# EAGLE design SX-VerteilerV3 (EAGLE 7.7.0)

## Sheet 1 of 2
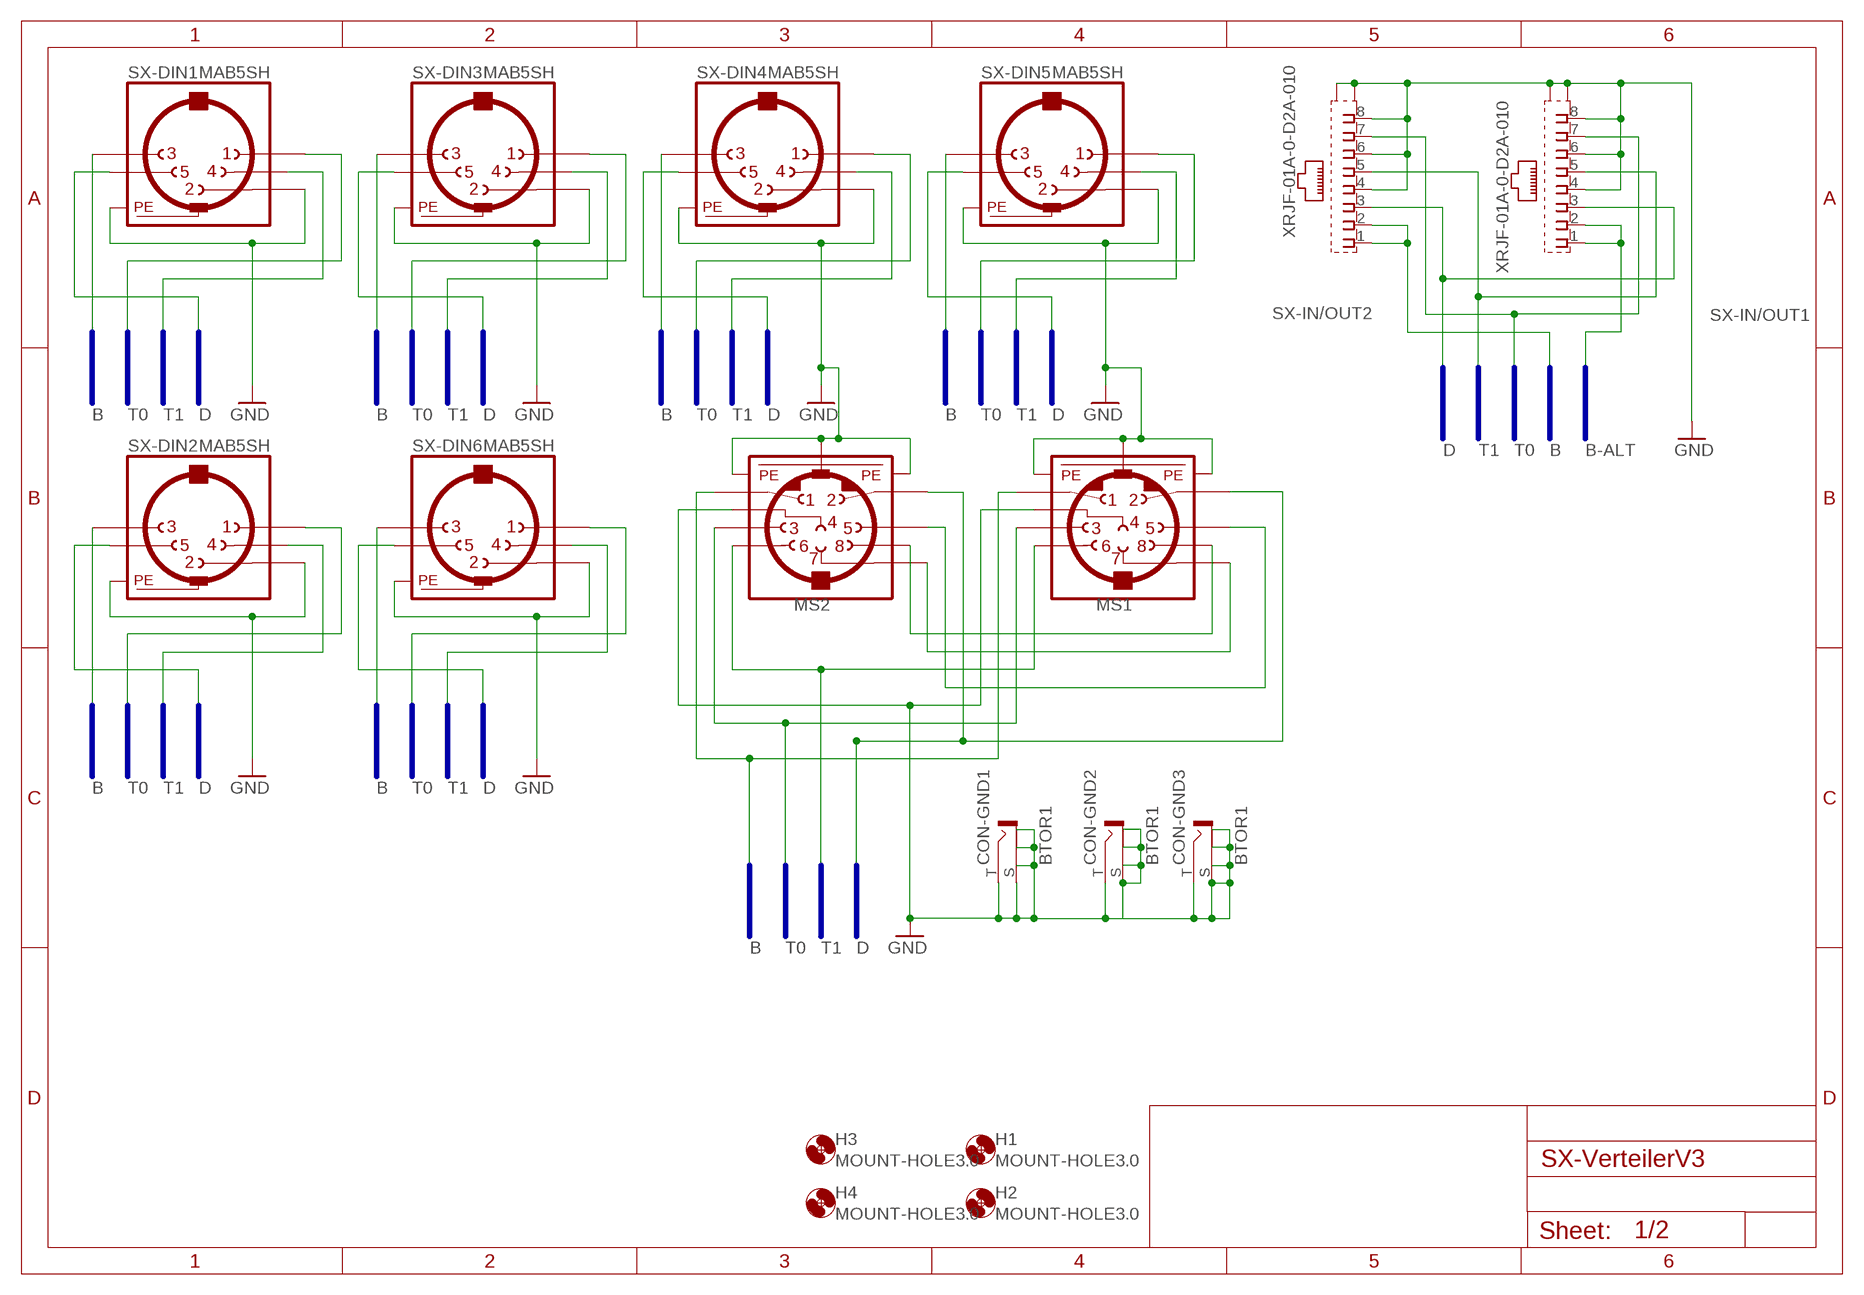
[diagram p0: schematic, sheet 1]

### Parts
CON-GND1  BTOR1  [BTOR1]
CON-GND2  BTOR1  [BTOR1]
CON-GND3  BTOR1  [BTOR1]
H1  MOUNT-HOLE3.0  [3,0]
H2  MOUNT-HOLE3.0  [3,0]
H3  MOUNT-HOLE3.0  [3,0]
H4  MOUNT-HOLE3.0  [3,0]
MS1  MINI_DIN_8  [M_DIN8]
MS2  MINI_DIN_8  [M_DIN8]
SX-DIN1  MAB5SH  [MAB5SH]
SX-DIN2  MAB5SH  [MAB5SH]
SX-DIN3  MAB5SH  [MAB5SH]
SX-DIN4  MAB5SH  [MAB5SH]
SX-DIN5  MAB5SH  [MAB5SH]
SX-DIN6  MAB5SH  [MAB5SH]
SX-IN/OUT1  XRJF-01A-0-D2A-010  [XRJF-01A-0-D2A-010]
SX-IN/OUT2  XRJF-01A-0-D2A-010  [XRJF-01A-0-D2A-010]

### Nets
B: MS1.1 MS2.1 SX-DIN1.3 SX-DIN2.3 SX-DIN3.3 SX-DIN4.3 SX-DIN5.3 SX-DIN6.3 SX-IN/OUT2.1 SX-IN/OUT2.2 ; also sheet 2
B-ALT: SX-IN/OUT1.1 SX-IN/OUT1.2 ; also sheet 2
D: MS1.2 MS2.2 SX-DIN1.5 SX-DIN2.5 SX-DIN3.5 SX-DIN4.5 SX-DIN5.5 SX-DIN6.5 SX-IN/OUT1.3 SX-IN/OUT2.3 ; also sheet 2
GND: CON-GND1.S CON-GND1.S@1 CON-GND1.S@2 CON-GND1.S@3 CON-GND1.T CON-GND2.S CON-GND2.S@1 CON-GND2.S@2 CON-GND2.S@3 CON-GND2.T CON-GND3.S CON-GND3.S@1 CON-GND3.S@2 CON-GND3.S@3 CON-GND3.T MS1.4 MS1.SH1(PE1) MS1.SH2(PE2) MS1.SH3(PE3) MS2.4 MS2.SH1(PE1) MS2.SH2(PE2) MS2.SH3(PE3) SX-DIN1.2 SX-DIN1.PE SX-DIN1.PE@(PE) SX-DIN2.2 SX-DIN2.PE SX-DIN2.PE@(PE) SX-DIN3.2 SX-DIN3.PE SX-DIN3.PE@(PE) SX-DIN4.2 SX-DIN4.PE SX-DIN4.PE@(PE) SX-DIN5.2 SX-DIN5.PE SX-DIN5.PE@(PE) SX-DIN6.2 SX-DIN6.PE SX-DIN6.PE@(PE) SX-IN/OUT1.4 SX-IN/OUT1.6 SX-IN/OUT1.8 SX-IN/OUT1.S1(S) SX-IN/OUT1.S2(S) SX-IN/OUT2.4 SX-IN/OUT2.6 SX-IN/OUT2.8 SX-IN/OUT2.S1(S) SX-IN/OUT2.S2(S) ; also sheet 2
N$1: MS1.8 MS2.8
N$3: MS1.7 MS2.7
N$5: MS1.5 MS2.5
T0: MS1.3 MS2.3 SX-DIN1.1 SX-DIN2.1 SX-DIN3.1 SX-DIN4.1 SX-DIN5.1 SX-DIN6.1 SX-IN/OUT1.7 SX-IN/OUT2.7 ; also sheet 2
T1: MS1.6 MS2.6 SX-DIN1.4 SX-DIN2.4 SX-DIN3.4 SX-DIN4.4 SX-DIN5.4 SX-DIN6.4 SX-IN/OUT1.5 SX-IN/OUT2.5 ; also sheet 2

### Buses
B
T0
T1
D
B-ALT

## Sheet 2 of 2
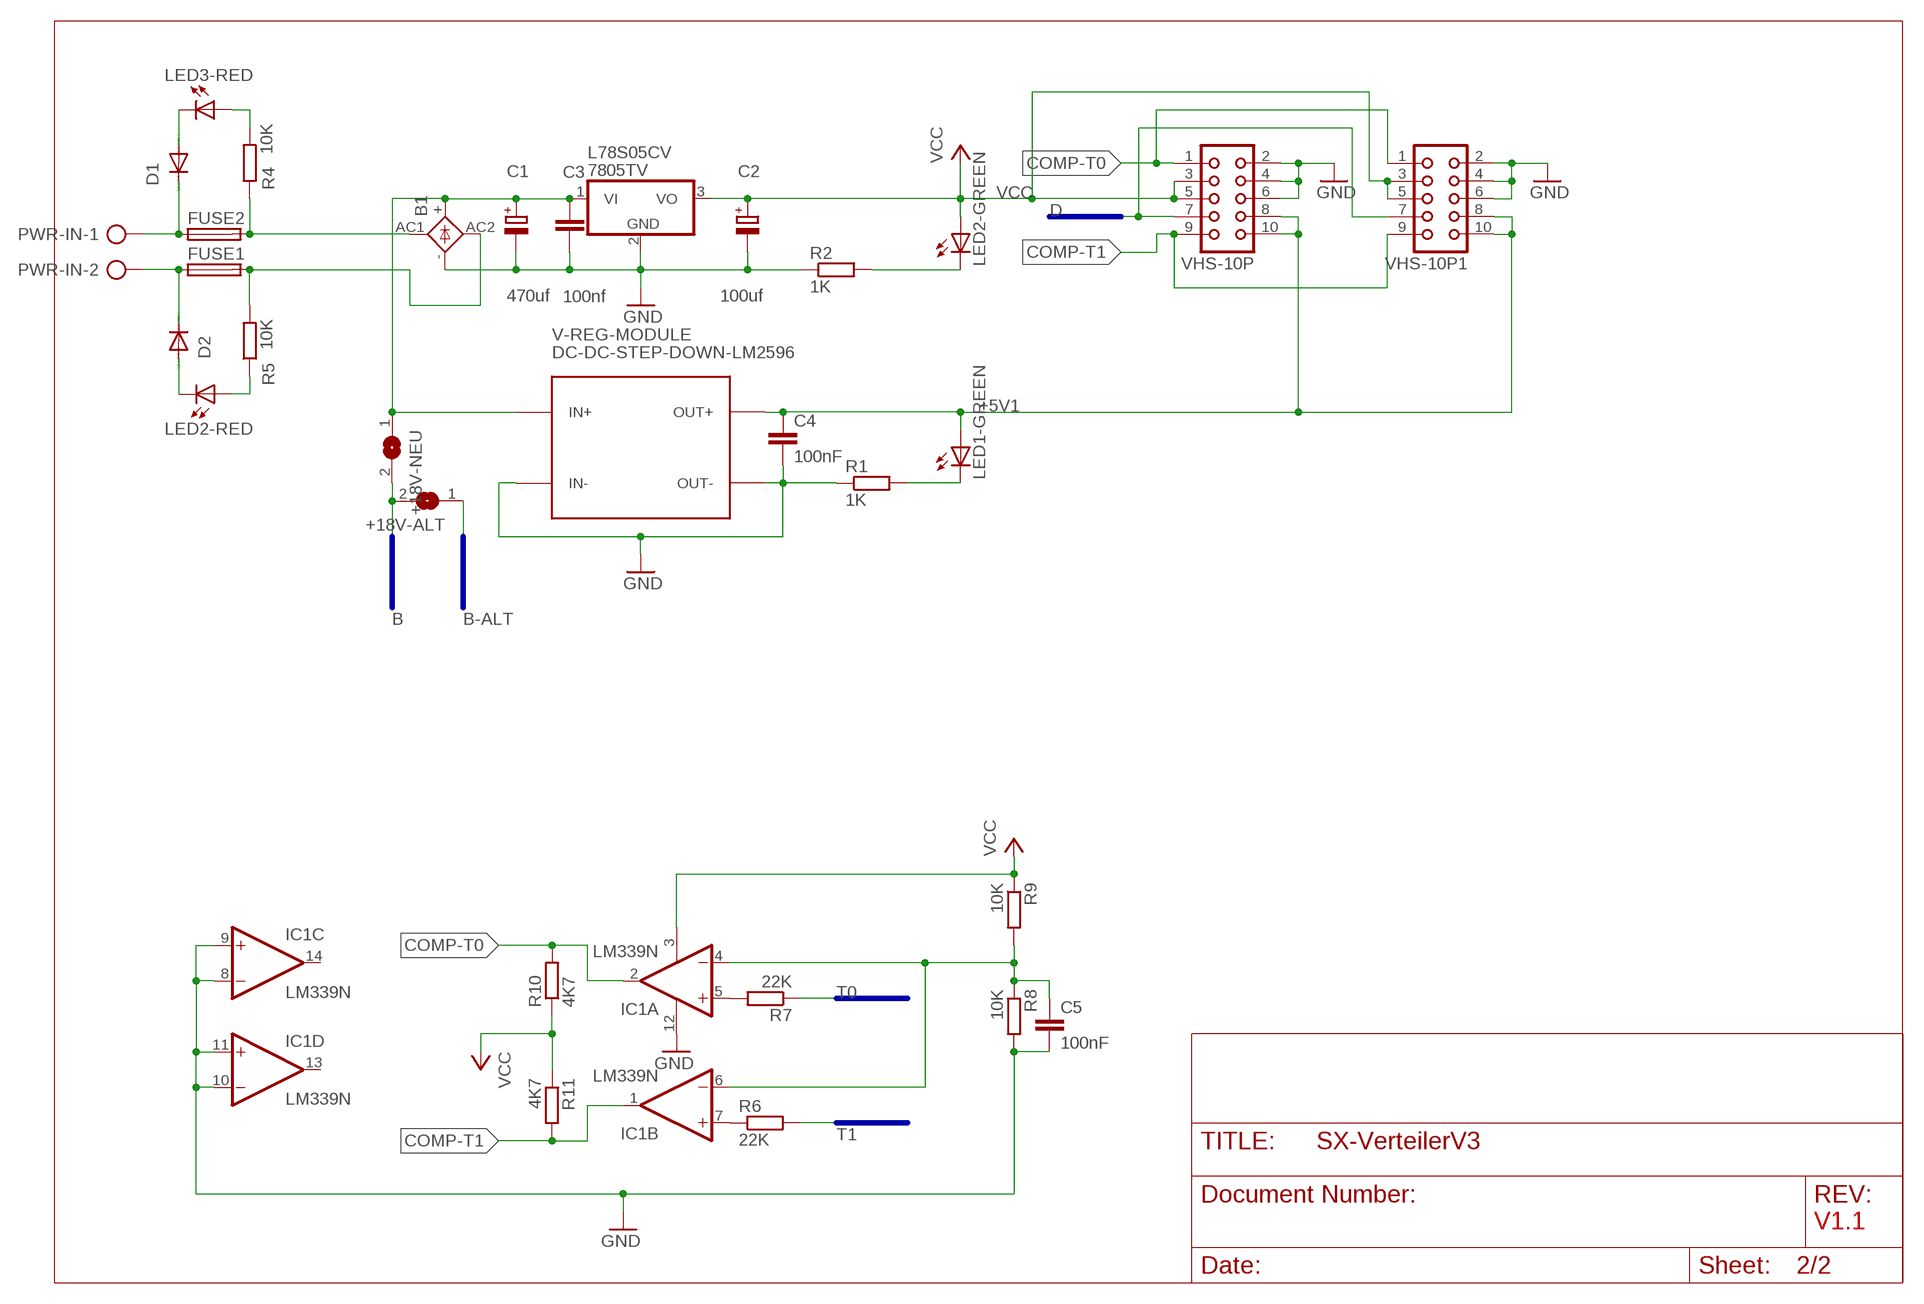
[diagram p1: schematic, sheet 2]

### Parts
+18V-ALT  SJW  [SJW]
+18V-NEU  SJW  [SJW]
B1  KBU  [KBU]
C1  470uf  CPOL-EUE5-13  [E5-13]
C2  100uf  CPOL-EUE3.5-8  [E3,5-8]
C3  100nf  C-EUC0805  [C0805]
C4  100nF  C-EUC0805  [C0805]
C5  100nF  C-EUC0805  [C0805]
D1  PMLL4150  [SOD80C]
D2  PMLL4150  [SOD80C]
FUSE1  FUSEBLANK_5X20MM  [FUSE_HOLDER_5X20MM]
FUSE2  FUSEBLANK_5X20MM  [FUSE_HOLDER_5X20MM]
IC1  LM339N  [DIL14]
L78S05CV  7805TV  [TO220V]
LED1-GREEN  LED3MM  [LED3MM]
LED2-GREEN  LED3MM  [LED3MM]
LED2-RED  LED3MM  [LED3MM]
LED3-RED  LED3MM  [LED3MM]
PWR-IN  AK300/2  [AK300/2]
R1  1K  R-EU_R0805  [R0805]
R2  1K  R-EU_R0805  [R0805]
R4  10K  R-EU_R0805  [R0805]
R5  10K  R-EU_R0805  [R0805]
R6  22K  R-EU_R0805  [R0805]
R7  22K  R-EU_R0805  [R0805]
R8  10K  R-EU_R0805  [R0805]
R9  10K  R-EU_R0805  [R0805]
R10  4K7  R-EU_R0805  [R0805]
R11  4K7  R-EU_R0805  [R0805]
V-REG-MODULE  DC-DC-STEP-DOWN-LM2596  [DC-DC-STEP-DOWN-LM2596]
VHS-10P  CON10  [CON10]
VHS-10P1  CON10  [CON10]

### Nets
+5V1: C4.1 LED1-GREEN.A V-REG-MODULE.OUT+ VHS-10P1.8 VHS-10P1.10 VHS-10P.8 VHS-10P.10
B: +18V-ALT.2 +18V-NEU.2 ; also sheet 1
B-ALT: +18V-ALT.1 ; also sheet 1
COMP-T0: IC1.2(A:OUT) R10.2 VHS-10P1.1 VHS-10P.1
COMP-T1: IC1.1(B:OUT) R11.2 VHS-10P1.9 VHS-10P.9
D: VHS-10P1.7 VHS-10P.7 ; also sheet 1
GND: B1.- C1.- C2.- C3.2 C4.2 C5.2 IC1.8(C:-IN) IC1.9(C:+IN) IC1.10(D:-IN) IC1.11(D:+IN) IC1.12(P:GND) L78S05CV.2(GND) R1.1 R2.1 R8.2 V-REG-MODULE.IN- V-REG-MODULE.OUT- VHS-10P1.2 VHS-10P1.4 VHS-10P1.6 VHS-10P.2 VHS-10P.4 VHS-10P.6 ; also sheet 1
N$2: D1.C FUSE2.1 PWR-IN.1
N$4: D2.C FUSE1.1 PWR-IN.2
N$6: B1.AC1 FUSE2.2 R4.1
N$7: B1.AC2 FUSE1.2 R5.2
N$8: D1.A LED3-RED.K(C)
N$9: IC1.5(A:+IN) R7.2
N$10: LED2-GREEN.K(C) R2.2
N$11: IC1.7(B:+IN) R6.1
N$12: LED1-GREEN.K(C) R1.2
N$13: LED3-RED.A R4.2
N$14: C5.1 IC1.4(A:-IN) IC1.6(B:-IN) R8.1 R9.2
N$15: D2.A LED2-RED.K(C)
N$16: LED2-RED.A R5.1
N$17: +18V-NEU.1 B1.+ C1.+ C3.1 L78S05CV.1(VI) V-REG-MODULE.IN+
T0: R7.1 ; also sheet 1
T1: R6.2 ; also sheet 1
VCC: C2.+ IC1.3(P:V+) L78S05CV.3(VO) LED2-GREEN.A R9.1 R10.1 R11.1 VHS-10P1.3 VHS-10P1.5 VHS-10P.3 VHS-10P.5
Unconnected: IC1.13(D:OUT) IC1.14(C:OUT)

### Buses
T1
T0
D
B
B-ALT

### Notes on the sheet
- V1.1

## Library data of the parts
+18V-ALT +18V-NEU = jumper:SJ: SMD solder JUMPER
B1 = rectifier:KBU: DIOTEC RECTIFIER
C1 C2 = resistor:CPOL-EU: POLARIZED CAPACITOR, European symbol
C3-C5 = resistor:C-EU: CAPACITOR, European symbol
CON-GND1-CON-GND3 = con-lumberg:BTOR1: RCA connectors according to JEITA RC-5231 Cinch RCA-Einbaukupplung nach JEITA RC-5231, stehende Ausführung Source: http://www.lumberg.de/Produkte/PDFs/BTOR1.pdf; OC_FARNELL: 1217030; OC_NEWARK: unknown
D1 D2 = diode:PMLL4150: DIODE high speed
FUSE1 FUSE2 = fuse:FUSE: Fuse; OC_FARNELL: unknown; OC_NEWARK: unknown
H1-H4 = holes:MOUNT-HOLE: MOUNTING HOLE with drill center marker
IC1 = linear:LM339: Low Power Low Offset Voltage Quad Comparators with open collector; LM139/LM239/LM339/LM2901/LM3302
L78S05CV = linear:78*: Positive VOLTAGE REGULATOR Source: http://cache.national.com/ds/LM/LM78L05.pdf http://www.fairchildsemi.com/ds/LM/LM7805.pdf
LED1-GREEN LED2-GREEN LED2-RED LED3-RED = led:LED: LED OSRAM: - CHIPLED LG R971, LG N971, LY N971, LG Q971, LY Q971, LO R971, LY R971 LH N974, LH R974 LS Q976, LO Q976, LY Q976 LO Q996 - Hyper CHIPLED LW Q18S LB Q993, LB Q99A, LB R99A - SideLED LS A670, LO A670, LY A670, LG A670, LP A670 LB A673, LV A673, LT A673, LW A673 LH A674 LY A675 LS A676, LA A676, LO A676, LY A676, LW A676 LS A679, LY A679, LG A679 - Hyper Micro SIDELED® LS Y876, LA Y876, LO Y876, LY Y876 LT Y87S - SmartLED LW L88C, LW L88S LB L89C, LB L89S, LG L890 LS L89K, LO L89K, LY L89K LS L896, LA L896, LO L896, LY L896 - TOPLED LS T670, LO T670, LY T670, LG T670, LP T670 LSG T670, LSP T670, LSY T670, LOP T670, LYG T670 LG T671, LOG T671, LSG T671 LB T673, LV T673, LT T673, LW T673 LH T674 LS T676, LA T676, LO T676, LY T676, LB T676, LH T676, LSB T676, LW T676 LB T67C, LV T67C, LT T67C, LS T67K, LO T67K, LY T67K, LW E67C LS E67B, LA E67B, LO E67B, LY E67B, LB E67C, LV E67C, LT E67C LW T67C LS T679, LY T679, LG T679 LS T770, LO T770, LY T770, LG T770, LP T770 LB T773, LV T773, LT T773, LW T773 LH T774 LS E675, LA E675, LY E675, LS T675 LS T776, LA T776, LO T776, LY T776, LB T776 LHGB T686 LT T68C, LB T68C - Hyper Mini TOPLED® LB M676 - Mini TOPLED Santana® LG M470 LS M47K, LO M47K, LY M47K Source: http://www.osram.convergy.de LUXEON: - LUMILED® LXK2-PW12-R00, LXK2-PW12-S00, LXK2-PW14-U00, LXK2-PW14-V00 LXK2-PM12-R00, LXK2-PM12-S00, LXK2-PM14-U00 LXK2-PE12-Q00, LXK2-PE12-R00, LXK2-PE12-S00, LXK2-PE14-T00, LXK2-PE14-U00 LXK2-PB12-K00, LXK2-PB12-L00, LXK2-PB12-M00, LXK2-PB14-N00, LXK2-PB14-P00, LXK2-PB14-Q00 LXK2-PR12-L00, LXK2-PR12-M00, LXK2-PR14-Q00, LXK2-PR14-R00 LXK2-PD12-Q00, LXK2-PD12-R00, LXK2-PD12-S00 LXK2-PH12-R00, LXK2-PH12-S00 LXK2-PL12-P00, LXK2-PL12-Q00, LXK2-PL12-R00 Source: www.luxeon.com KINGBRIGHT: KA-3528ASYC Source: www.kingbright.com
MS1 MS2 = mini_din:MINI_DIN_8
PWR-IN = con-ptr500:AK300/2: CONNECTOR; OC_FARNELL: unknown; OC_NEWARK: unknown
R1 R2 R4-R11 = resistor:R-EU_: RESISTOR, European symbol
SX-DIN1-SX-DIN6 = con-hirschmann:MAB5SH: Female CONNECTOR 5 pins 90 deg. with shield, horizontal (DIN 41524); OC_FARNELL: 809883; OC_NEWARK: unknown
SX-IN/OUT1 SX-IN/OUT2 = con-xmultiple:XRJF: RC45 schielded, without LED, with transformer, side entry PCB Jack Source: XRJF-01A-0-D2A-010(01).pdf
V-REG-MODULE = diy-modules:DC-DC-STEP-DOWN-LM2596: DC/DC Step-Down Regulator based on LM2596-ADJ chip
VHS-10P VHS-10P1 = con-harting:CON10: CONNECTOR; OC_FARNELL: unknown; OC_NEWARK: unknown

## Board
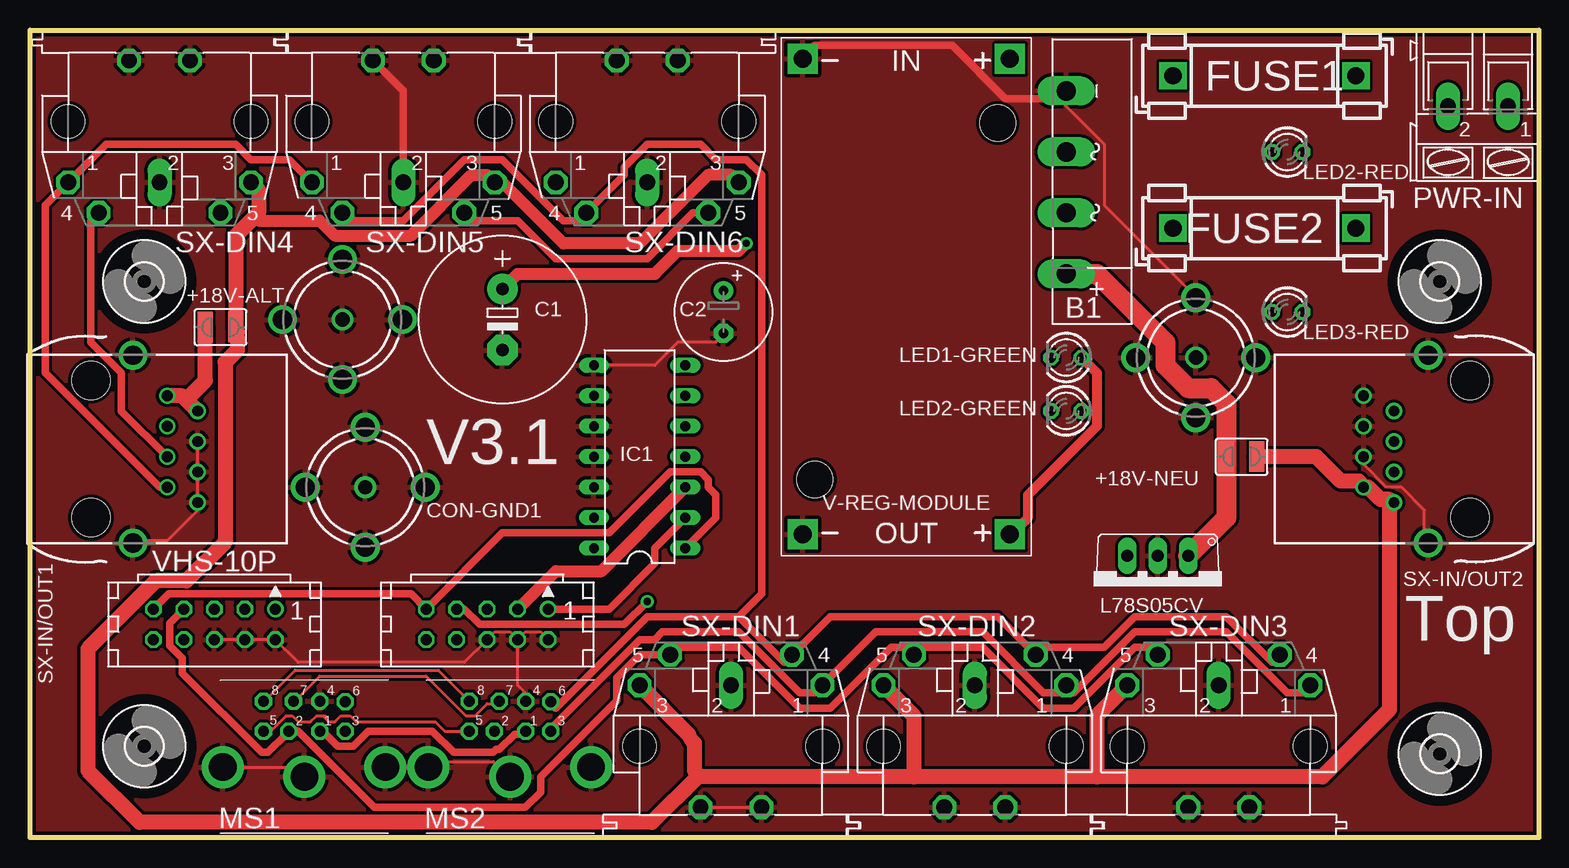
[diagram p2: board, top side]
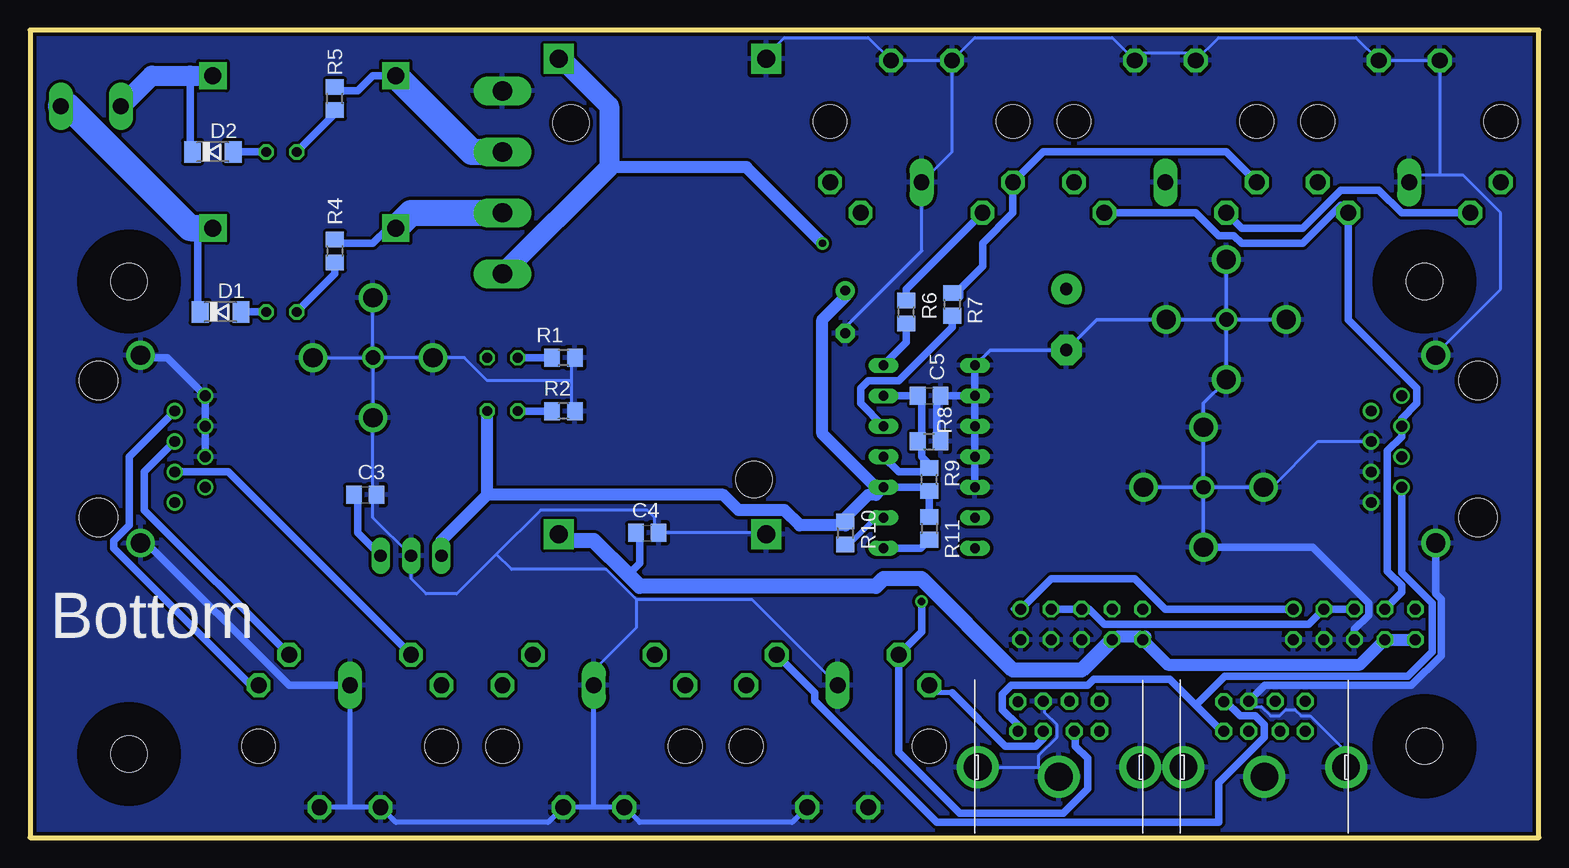
[diagram p3: board, bottom side, seen from below]

Size 125.73 x 67.31 mm. Coordinates in mm from the lower left corner, seen from the top.
Outline: 0,0 0,67.31 125.73,67.31 125.73,0 0,0
Copper layers (1*16): Top 0.035mm / dielectric 0.2mm / Bottom 0.035mm
Design rules "Eagle_WEdirekt_150_check *": minimum track width 6mil, minimum drill 0.25mm, track to track 6mil, track to pad 8mil, pad to pad 8mil, via to via 6mil, smd to smd 8mil, copper to edge 12mil, drill to drill 24mil, minimum pad ring 9mil, minimum via ring 9mil, stop-mask expansion 3mil, vias tented up to drill 0mil, thermal gap 12mil
bRestrict: area 54.6,25.4 to 55.2,26; area 54.6,24.8 to 55.2,25.4

### Footprints (pad centres in the part's own frame; a part is rotated, then mirrored left to right if it is on the bottom)
SJW = smd 1.27 x 2.54: 1 -1.27,0; 2 1.27,0
KBU = drill 1.6 long: + -7.62,2.54; - 7.62,2.54; AC1 -2.54,2.54; AC2 2.54,2.54
E5-13 = drill 1.016 pad 2.54: + -2.54,0 | drill 1.016 pad 2.54 octagon: - 2.54,0
E3,5-8 = drill 0.813 pad 1.6: + -1.778,0 | drill 0.813 pad 1.6 octagon: - 1.778,0
C0805 = smd 1.3 x 1.5: 1 -0.95,0; 2 0.95,0
BTOR1 = drill 1.6 pad 2.2: S -5,0; S@1 0,5; S@2 5,0; S@3 0,-5 | drill 1.2 pad 1.6: T 0,0
SOD80C = smd 1.4 x 1.8: A 1.7,0; C -1.7,0
FUSE_HOLDER_5X20MM = drill 1.422 pad 2.286 square: 1 0,0; 2 15.24,0
3,0 = hole 3: 0,0
DIL14 = drill 0.813 long: 1 -7.62,-3.81; 2 -5.08,-3.81; 3 -2.54,-3.81; 4 0,-3.81; 5 2.54,-3.81; 6 5.08,-3.81; 7 7.62,-3.81; 8 7.62,3.81; 9 5.08,3.81; 10 2.54,3.81; 11 0,3.81; 12 -2.54,3.81; 13 -5.08,3.81; 14 -7.62,3.81
TO220V = drill 1.016 long: 1 -2.54,-2.54; 2 0,-2.54; 3 2.54,-2.54
LED3MM = drill 0.813 octagon: A -1.27,0; K 1.27,0
M_DIN8 = drill 0.9 pad 1.422 octagon: 1 -1.3,-3.8; 2 1.3,-3.8; 3 -3.4,-3.8; 4 -1.3,-6.3; 5 3.4,-3.8; 6 -3.4,-6.25; 7 0.9,-6.3; 8 3.4,-6.3 | drill 2.3 pad 3.5: SH1 6.8,-0.8; SH2 0,0; SH3 -6.75,-0.8
AK300/2 = drill 1.321 long: 1 -2.515,0; 2 2.489,0
R0805 = smd 1.3 x 1.5: 1 -0.95,0; 2 0.95,0
MAB5SH = drill 1.321 octagon: 1 7.62,5.08; 3 -7.62,5.08; 4 5.08,7.62; 5 -5.08,7.62; PE -2.54,-5.08; PE@ 2.54,-5.08 | drill 1.321 long: 2 0,5.08 | hole 2.794: 7.62,0; -7.62,0
XRJF-01A-0-D2A-010 = drill 0.9 pad 1.27: 1 -4.445,6.35; 2 -3.175,8.89; 3 -1.905,6.35; 4 -0.635,8.89; 5 0.635,6.35; 6 1.905,8.89; 7 3.175,6.35; 8 4.445,8.89 | drill 1.6 pad 2.184: S1 -7.825,3.5; S2 7.825,3.5 | hole 3.2: -5.715,0; 5.715,0
DC-DC-STEP-DOWN-LM2596 = drill 1.5 pad 2.5 square: IN+ -19.812,8.636; IN- -19.812,-8.636; OUT+ 19.812,8.636; OUT- 19.812,-8.636 | hole 3: -14.478,7.62; 15.24,-7.62
CON10 = drill 0.914: 1 -5.08,-1.27 | drill 0.914 octagon: 2 -5.08,1.27; 3 -2.54,-1.27; 4 -2.54,1.27; 5 0,-1.27; 6 0,1.27; 7 2.54,-1.27; 8 2.54,1.27; 9 5.08,-1.27; 10 5.08,1.27

### Placement (x,y rotation side)
+18V-ALT  15.88,42.55 0 top
+18V-NEU  100.97,31.75 0 top
B1  88.9,54.61 90 top
C1  39.37,43.18 270 top
C2  57.78,43.81 270 top
C3  97.79,28.57 0 bottom
C4  74.3,25.4 0 bottom
C5  50.8,36.83 0 bottom
CON-GND1  27.94,29.21 0 top
CON-GND2  26.04,43.18 0 top
CON-GND3  97.16,40.01 0 top
D1  109.86,43.81 0 bottom
D2  110.49,57.15 0 bottom
FUSE1  110.49,63.5 180 top
FUSE2  110.49,50.8 180 top
H1  117.47,6.99 0 top
H2  9.53,46.35 0 top
H3  117.47,46.35 0 top
H4  9.53,7.62 0 top
IC1  50.8,31.75 90 top
L78S05CV  93.98,20.95 180 top
LED1-GREEN  86.36,40.01 180 top
LED2-GREEN  86.36,35.56 180 top
LED2-RED  104.78,57.15 0 top
LED3-RED  104.78,43.81 0 top
MS1  22.86,5.08 180 top
MS2  40.01,5.08 180 top
PWR-IN  120.65,60.96 180 top
R1  81.28,40.01 180 bottom
R2  81.28,35.56 180 bottom
R4  100.33,48.9 270 bottom
R5  100.33,61.59 90 bottom
R6  52.7,43.81 90 bottom
R7  48.9,44.45 270 bottom
R8  50.8,33.02 0 bottom
R9  50.8,29.84 90 bottom
R10  57.78,25.4 270 bottom
R11  50.8,25.78 270 bottom
SX-DIN1  58.42,7.62 0 top
SX-DIN2  78.74,7.62 0 top
SX-DIN3  99.06,7.62 0 top
SX-DIN4  10.79,59.69 180 top
SX-DIN5  31.11,59.69 180 top
SX-DIN6  51.44,59.69 180 top
SX-IN/OUT1  5.08,32.38 270 top
SX-IN/OUT2  120.02,32.38 90 top
V-REG-MODULE  73.03,45.09 270 top
VHS-10P  15.37,17.78 180 top
VHS-10P1  38.1,17.78 180 top

### Tracks (layer width: path | path; a pad name or v marks a point on that pad's centre or on a via)
+5V1
  Top 0.813: V-REG-MODULE.OUT+ 81.92,25.4 83.19,26.67 83.19,28.57 88.9,34.29 88.9,38.73 LED1-GREEN.A
  Bottom 0.61: 75.88,21.91 74.93,22.86 74.93,25.4 C4.1
  Bottom 1.016: 32.77,16.76 VHS-10P1.10 | VHS-10P1.8 35.05,16.76 33.27,16.76 VHS-10P1.10 | VHS-10P1.10 30.94,14.43 14.91,14.43 VHS-10P.8 VHS-10P.10
  Bottom 1.27: VHS-10P1.8 38.1,13.97 43.81,13.97 51.44,21.59 54.61,21.59 55.24,20.95 74.93,20.95 75.88,21.91 78.74,24.77 81.28,24.77 V-REG-MODULE.OUT+
B
  Top 0.61: MS1.1 24.38,8.89 25.65,7.62 26.92,7.62 28.19,8.89 33.53,8.89 35.31,7.11 38.61,7.11 38.86,7.37 39.12,7.37 40.39,8.64 41.15,8.64 MS2.1
  Top 1.016: 18.73,51.75 19.05,51.44 24.13,51.44 25.4,50.16 31.75,50.16 36.83,55.24 38.1,55.24 SX-DIN5.3 39.37,54.61 44.45,49.53 50.8,49.53 56.52,55.24 58.42,55.24 SX-DIN6.3
  Top 1.27: +18V-ALT.2 17.14,50.16 18.73,51.75 19.05,52.07 19.05,53.98 SX-DIN4.3 | +18V-NEU.2 107.19,31.75 109.22,29.72 110.74,29.72 SX-IN/OUT2.2 111.51,29.21 112.52,28.19 113.28,28.19 113.54,27.94 SX-IN/OUT2.1 113.28,27.43 113.28,10.67 107.7,5.08 88.9,5.08 | 55.63,5.08 51.82,1.27 9.14,1.27 4.83,5.59 4.83,12.19 4.83,15.74 10.49,21.41 13.03,21.41 16.26,24.64 16.26,39.62 17.27,40.64 17.27,41.66 +18V-ALT.2 | 88.9,5.08 73.66,5.08 | 73.66,5.08 55.63,5.08 | 17.27,42.16 +18V-ALT.2 | 73.66,5.08 73.66,10.16 SX-DIN2.3 | 88.9,5.08 88.9,10.16 SX-DIN3.3 | SX-DIN1.3 54.86,8.64 55.12,8.13 55.37,7.87 55.37,5.59 55.63,5.08
  Bottom 0.406: 48.9,12.06 50.8,12.06 SX-DIN1.3
  Bottom 0.61: 48.9,12.06 44.45,7.62 41.91,7.62 41.27,8.26 MS2.1
B-ALT
  Top 1.27: SX-IN/OUT1.1 12.7,36.83 13.02,36.51 | SX-IN/OUT1.2 13.02,36.51 | +18V-ALT.1 14.61,38.1 13.02,36.51
COMP-T0
  Top 0.61: VHS-10P1.1 48.26,19.05 52.07,22.86 52.07,24.13 IC1.2
  Bottom 0.406: R10.2 57.78,24.13 55.24,26.67 IC1.2 | VHS-10P1.1 43.81,19.05
  Bottom 0.61: VHS-10P1.1 40.64,21.59 33.66,21.59 32.96,20.89 31.11,19.05 VHS-10P.1
COMP-T1
  Top 0.61: IC1.1 57.15,26.67 57.15,28.57 56.52,29.21 56.52,29.84 55.88,30.48 53.34,30.48 48.26,25.4 39.37,25.4 VHS-10P1.9 31.75,20.32 11.56,20.32 VHS-10P.9
  Bottom 0.61: R11.2 51.5,24.13 IC1.1
D  (via drill 0.6)
  Top 0.61: SX-DIN3.5 93.34,15.88 92.08,15.88 87,10.79 84.45,10.79 79.38,15.88 74.3,15.88 SX-DIN2.5 73.03,15.88 71.75,15.88 66.67,10.79 64.14,10.79 59.05,15.88 53.98,15.88 SX-DIN1.5 50.8,15.24 48.9,13.34 48.9,11.43 42.55,5.08 42.55,3.81 41.27,2.54 28.7,2.54 22.35,8.89 21.84,8.89 MS1.2 21.34,8.64 19.81,7.11 19.3,7.11 12.7,13.72 12.7,14.95 11.63,16.02 11.63,17.86 VHS-10P.7 | SX-DIN6.5 55.24,52.07 51.44,48.26 43.81,48.26 40.64,51.44 36.83,51.44 SX-DIN5.5 | VHS-10P1.7 36.2,19.05 37.47,17.78 49.53,17.78 v51.44,19.68
  Bottom 0.61: SX-IN/OUT2.3 109.22,30.48 SX-DIN3.5 | SX-DIN5.5 28.57,52.07 26.67,50.16 25.4,50.16 24.77,49.53 19.68,49.53 16.51,52.7 SX-DIN4.5 15.88,43.18 10.16,37.47 10.16,36.2 11.43,34.92 SX-IN/OUT1.3 11.43,33.43 12.62,32.24 12.62,22.21 11.43,21.02 11.43,20.45 VHS-10P.7 | v51.44,19.68 51.44,17.14 SX-DIN1.5 53.34,7.11 48.26,2.03 39.62,2.03 37.59,4.06 37.59,6.6 38.61,7.62 38.61,8.64 MS2.2
GND
  Top 0.254: SX-IN/OUT2.4 111.12,31.11 113.03,29.21 114.3,29.21 116.2,27.3 116.2,24.77 SX-IN/OUT2.S1 | SX-IN/OUT1.S2 8.89,24.77 11.43,24.77 13.97,27.3 SX-IN/OUT1.8 SX-IN/OUT1.6 SX-IN/OUT1.4 | VHS-10P1.4 40.64,12.7 41.15,12.19 41.27,12.06 41.3,12.04 MS2.4 | VHS-10P1.4 40.01,17.14 38.73,17.14 VHS-10P1.6 36.2,14.61 22.35,14.61 VHS-10P.2 VHS-10P.4 VHS-10P.6 | VHS-10P1.2 42.55,17.14 41.27,17.14 VHS-10P1.4 | SX-DIN1.PE SX-DIN1.PE@ | 85.72,61.59 89.53,57.78 89.53,52.7 97.16,45.09 CON-GND3.S@1 | C2.- 57.78,41.91 57.15,41.27 53.98,41.27 52.07,39.37 IC1.8 | MS2.SH2 39.88,5.08 38.61,6.35 33.53,6.35 33.27,6.1 MS2.SH1 33.02,5.84 29.72,5.84 MS1.SH3 | MS1.SH2 22.1,5.84 16.26,5.84 MS1.SH1
  Top 0.61: B1.- 85.72,61.59 81.28,61.59 76.83,66.04 65.41,66.04 64.77,65.41 V-REG-MODULE.IN- | SX-DIN5.2 31.11,62.23 SX-DIN5.PE@
  Bottom 0.254: SX-DIN6.PE@ 46.99,66.67 35.56,66.67 SX-DIN5.PE 33.02,65.41 29.21,65.41 SX-DIN5.PE@ 26.67,66.67 15.24,66.67 SX-DIN4.PE SX-DIN4.PE@ 8.26,55.24 | SX-DIN6.PE@ SX-DIN6.PE 55.88,66.67 62.87,66.67 64.14,65.41 V-REG-MODULE.IN- | SX-DIN6.PE@ 48.9,57.15 SX-DIN6.2 51.44,48.9 | SX-IN/OUT1.S1 8.26,40.64 3.17,45.72 3.17,52.07 6.35,55.24 8.26,55.24 | 8.26,55.24 10.16,55.24 SX-DIN4.2 | V-REG-MODULE.OUT- 64.77,25.4 C4.2 73.66,25.4 73.66,26.67 74.3,27.3 83.19,27.3 86.87,23.62 | CON-GND1.S 22.23,29.21 18.41,33.02 SX-IN/OUT1.4 | 97.16,28.57 CON-GND3.S@3 CON-GND3.T | 80.64,38.1 80.64,40.01 R1.1 | 80.64,38.1 80.64,35.56 R2.1 | 80.64,38.1 87.63,38.1 89.53,40.01 CON-GND3.S CON-GND3.T | CON-GND3.T CON-GND3.S@1 | CON-GND3.S@2 CON-GND3.T | 97.16,28.57 97.16,26.67 L78S05CV.2 93.98,21.59 92.71,20.32 90.17,20.32 86.87,23.62 | 97.16,28.57 C3.2 | 41.66,5.84 40.89,5.84 40.13,5.08 MS2.SH2 41.66,5.84 | 41.66,5.84 46.74,5.84 MS2.SH3 | 41.66,5.84 41.66,6.86 40.13,8.38 40.13,9.4 41.15,10.41 41.15,11.22 MS2.4 | 75.18,19.81 77.72,22.35 85.6,22.35 86.87,23.62 | 75.18,19.81 65.53,19.81 SX-DIN1.2 | 75.18,19.81 75.18,17.53 78.74,13.97 SX-DIN2.2 | MS1.SH1 16.26,6.1 16.26,7.37 19.05,10.16 19.81,10.16 20.32,10.67 21.08,10.67 21.59,10.16 22.35,10.16 23.11,10.92 23.88,10.92 24.13,11.18 MS1.4 | 8.64,24.38 SX-IN/OUT1.S2
  Bottom 0.305: 51.44,48.9 57.78,42.55 C2.- | CON-GND1.T CON-GND1.S@3 | CON-GND1.S CON-GND1.T | CON-GND1.S@2 CON-GND1.T | CON-GND1.T CON-GND1.S@1 27.94,36.2 26.04,38.1 CON-GND2.S@3 CON-GND2.T | CON-GND2.S CON-GND2.T | CON-GND2.T CON-GND2.S@2 36.83,43.18 C1.- 45.72,40.64 IC1.8 | CON-GND2.T CON-GND2.S@1
  Bottom 0.406: SX-DIN1.PE@ 62.23,1.27 74.93,1.27 SX-DIN2.PE 78.74,2.54 | 78.74,2.54 SX-DIN2.PE@ 82.55,1.27 95.25,1.27 SX-DIN3.PE 99.06,2.54 | 99.06,2.54 SX-DIN3.PE@ | 78.74,2.54 SX-DIN2.2 | 99.06,2.54 SX-DIN3.2
  Bottom 0.61: SX-IN/OUT2.4 SX-IN/OUT2.6 SX-IN/OUT2.8 114.3,40.01 116.2,40.01 SX-IN/OUT2.S2 | SX-DIN3.2 104.14,12.7 116.2,24.77 SX-IN/OUT2.S1 | R8.2 50.16,33.02 50.16,36.83 C5.2 IC1.9 | IC1.8 IC1.9 | IC1.9 IC1.10 IC1.11 IC1.12 | VHS-10P.6 15.37,17.36 14.17,18.56 14.17,19.54 18.84,24.21 CON-GND1.S@3 | MS1.4 22.84,12.7 10.61,12.7 8.13,15.18 8.13,19.87 8.58,20.33 SX-IN/OUT1.S2
  pour Bottom (isolate 0.254): 0,0 0,67.31 125.73,67.31 125.73,0
  pour Top (isolate 0.254): 0,0 0,67.31 125.73,67.31 125.73,0
N$1
  Top 0.254: MS2.8 36.58,11.43 34.04,13.97 22.1,13.97 19.56,11.43 MS1.8
N$2
  Bottom 0.61: 111.76,50.8 111.76,43.81 D1.C
  Bottom 2.184: FUSE2.1 111.76,50.8 112.39,50.8 122.56,60.96 PWR-IN.1
N$3
  Top 0.254: MS2.7 38.86,11.18 38.1,11.18 37.08,10.16 36.32,10.16 33.02,13.46 24.13,13.46 22.1,11.43 MS1.7
N$4
  Bottom 0.61: 112.39,63.5 112.39,57.15 D2.C
  Bottom 1.676: FUSE1.1 112.39,63.5 115.57,63.5 118.11,60.96 PWR-IN.2
N$5
  Top 0.254: 24.38,10.16 23.88,10.16 23.37,9.65 22.35,9.65 21.84,10.16 21.34,10.16 20.07,8.89 19.56,8.89 MS1.5 | 24.38,10.16 24.64,10.16 | 24.38,10.16 24.89,9.65 25.4,9.65 25.91,10.16 26.67,10.16 27.18,9.65 33.78,9.65 34.54,8.89 36.58,8.89 MS2.5
N$6
  Bottom 0.61: R4.1 100.33,49.53 97.16,49.53 95.89,50.8 FUSE2.2
  Bottom 2.184: B1.AC1 93.98,52.07 FUSE2.2
N$7
  Bottom 0.61: FUSE1.2 97.16,63.5 98.42,62.23 100.33,62.23 R5.2
  Bottom 2.184: B1.AC2 88.9,57.15 FUSE1.2
N$8
  Bottom 0.61: LED3-RED.K D1.A
N$9
  Bottom 0.61: R7.2 48.9,42.55 53.34,38.1 55.88,38.1 56.52,37.47 56.52,36.2 IC1.5
N$10
  Bottom 0.61: R2.2 LED2-GREEN.K
N$11
  Bottom 0.61: R6.1 52.7,41.27 IC1.7
N$12
  Bottom 0.61: LED1-GREEN.K R1.2
N$13
  Bottom 0.61: LED3-RED.A 100.33,46.99 R4.2
N$14
  Bottom 0.61: 51.44,33.02 51.44,31.75 50.8,31.11 R9.2 50.8,30.48 53.34,30.48 IC1.4 | IC1.6 C5.1 51.44,36.83 51.44,33.02 | 51.44,33.02 R8.1
N$15
  Bottom 0.61: LED2-RED.K D2.A
N$16
  Bottom 0.61: LED2-RED.A 100.33,60.33 R5.1
N$17  (via drill 0.6)
  Top 1.016: v59.69,49.53 59.05,48.9 53.98,48.9 52.07,46.99 40.64,46.99 C1.+
  Top 1.676: B1.+ 88.9,46.99 94.61,41.27 94.61,39.37 96.52,37.47 98.42,37.47 99.69,36.2 +18V-NEU.1 99.69,26.67 L78S05CV.1
  Bottom 0.61: 99.06,28.57 C3.1 98.42,28.57 98.42,25.4 L78S05CV.1
  Bottom 1.016: 77.47,55.88 66.04,55.88 v59.69,49.53
  Bottom 1.676: B1.+ 77.47,55.88 77.47,60.96 81.28,64.77 V-REG-MODULE.IN+
T0
  Top 0.61: SX-DIN5.1 21.59,56.52 18.41,56.52 17.14,57.78 6.35,57.78 SX-DIN4.1 1.27,52.7 1.27,38.73 10.79,29.21 SX-IN/OUT1.7 | SX-DIN3.1 106.05,12.06 104.78,12.06 99.69,17.14 92.08,17.14 87,12.06 SX-DIN2.1 85.72,12.06 84.45,12.06 79.38,17.14 70.48,17.14 SX-DIN1.1 65.41,12.06 64.14,12.06 59.05,17.14 52.7,17.14 52.07,16.51 50.8,16.51 43.18,8.89 MS2.3
  Bottom 0.61: SX-DIN5.1 26.04,57.15 41.27,57.15 SX-DIN6.1 43.81,52.07 46.35,49.53 46.35,47.62 48.26,45.72 48.26,45.09 48.9,45.09 R7.1 | SX-IN/OUT2.7 117.47,31.75 117.47,26.04 118.75,24.77 118.75,24.13 107.31,12.7 SX-DIN3.1 | 28.57,11.05 26.42,8.89 MS1.3 | 28.57,11.05 30.73,13.21 37.08,13.21 37.59,12.7 43.94,12.7 44.7,11.94 44.7,10.67 43.43,9.4 43.43,8.89 MS2.3 | 28.57,11.05 26.16,13.46 16.76,13.46 15.75,13.46 10.92,13.46 8.89,15.49 8.89,19.56 11.43,22.1 SX-IN/OUT1.7
T1
  Top 0.61: SX-DIN5.4 26.67,51.44 31.11,51.44 36.2,56.52 39.37,56.52 44.45,51.44 45.72,51.44 SX-DIN6.4 49.53,55.24 49.53,55.88 51.44,57.78 55.88,57.78 57.15,56.52 59.69,56.52 60.96,55.24 60.96,20.32 59.05,18.41 | SX-IN/OUT1.5 7.62,35.56 7.62,38.73 5.08,41.27 5.08,51.44 SX-DIN4.4 | SX-DIN3.4 103.5,14.61 99.69,18.41 92.08,18.41 89.53,15.88 84.45,15.88 SX-DIN2.4 80.64,18.41 66.67,18.41 SX-DIN1.4 62.87,14.61 59.05,18.41 | 59.05,18.41 51.44,18.41 43.81,10.79 MS2.6
  Bottom 0.61: SX-DIN5.4 24.77,50.8 19.68,50.8 16.51,53.98 13.34,53.98 11.43,52.07 SX-DIN4.4 | SX-DIN3.4 116.2,27.3 116.2,30.48 SX-IN/OUT2.5 | SX-DIN6.4 52.7,45.72 R6.2 | SX-DIN1.4 60.33,12.06 60.33,11.43 50.16,1.27 26.67,1.27 26.67,4.57 22.86,8.38 22.86,9.4 23.62,10.16 24.89,10.16 26.16,11.43 MS1.6
VCC
  Top 1.016: IC1.3 47.62,22.23 43.81,22.23 VHS-10P1.3
  Bottom 0.61: IC1.3 50.8,29.21 R9.1 R11.1 | VHS-10P1.3 VHS-10P1.5 37.47,19.05 36.2,17.78 35.18,17.78 35.13,17.81 35.05,17.78 19.18,17.78 VHS-10P.3 VHS-10P.5
  Bottom 1.016: 87.63,28.57 LED2-GREEN.A | 87.63,28.57 67.94,28.57 66.67,27.3 62.87,27.3 61.59,26.04 57.78,26.04 R10.1 57.78,26.67 55.88,28.57 55.24,28.57 IC1.3 55.24,29.21 59.69,33.66 59.69,43.18 57.78,45.09 C2.+ | L78S05CV.3 91.44,24.77 87.63,28.57

### Text on the board
tNames: V3.1 | Top
bNames: Bottom